# EasyEDA Pro project NU1680无线充电接收端底座.eprj, board 转接座
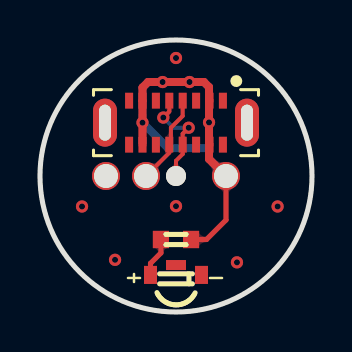
[diagram p4: board, top side]
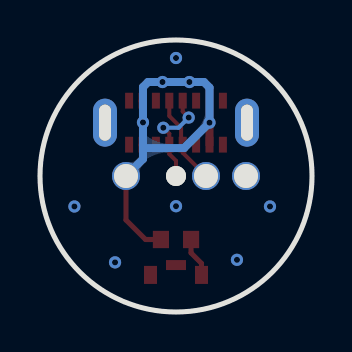
[diagram p5: board, bottom side, seen from below]

Outline 13.6 x 13.6 mm; copper layers: Top Layer, Bottom Layer. Coordinates in mm from the lower left corner of the outline.
Outline path: circle c6.8,6.8 r6.8
Stack: Top Layer 0.035mm / Dielectric1 1.51mm FR4 er 4.5 / Bottom Layer 0.035mm

## Design rules (mm)
net USB_DV_D+: DP1
net USB_DV_D-: DP1
template: JLCPCB Capability(Two Layers Board)
spacing copperThickness1oz (default): track to track 0.102, other pairs 0.152 to 0.3
spacing copperThickness2oz: track to track 0.203, other pairs 0.152 to 0.3
track width copperThickness1oz (default): min 0.127, default 0.254, max 2.54
track width copperThickness2oz: min 0.203, default 0.254, max 2.54
differential pair differentialPair (default): width min 0.127, default 0.254, max 2.54; gap min 0.152, default 0.152
via viaSize (default): diameter min 0.5, default 0.61, max 10; hole min 0.3, default 0.305, max 6.3

## Placement (name value [footprint] x y rotation side)
LED1  OUT  [LED-SMD_L3.2-W1.0-R-RD]  6.8 2.1 180 top
R1  1k  [R0603]  6.8 3.63 0 top
U1  -  [磁吸充电母座]  6.8 6.8 180 bottom
USB1  YTC-TC16S-128  [TYPE-C-SMD_YTC-TC16S-128]  6.8 9.47 0 top

## Footprints (pads in the part's own frame, mm; a bottom-side part is the same pattern mirrored in y, then rotated)
LED-SMD_L3.2-W1.0-R-RD
  rect 0.65x0.9 smd: 1(1.275,0.247) 2(-1.275,0.247)
  rect 1x0.5 smd: 3(0,-0.247)
R0603
  rect 0.806x0.864 smd: 1(-0.753,0) 2(0.753,0)
TYPE-C-SMD_YTC-TC16S-128
  rect 0.4x0.79 smd: A1(2.345,1.1) A4(1.675,1.1) A5(1.005,1.1) A6(0.335,1.1) A7(-0.335,1.1) A8(-1.005,1.1) A9(-1.675,1.1) A12(-2.345,1.1) B1(-2.345,-1.1) B4(-1.675,-1.1) B5(-1.005,-1.1) B6(-0.335,-1.1) B7(0.335,-1.1) B8(1.005,-1.1) B9(1.675,-1.1) B12(2.345,-1.1)
  oval 1.2x2.4 hole 0.6x1.8: EH1(-3.55,0) EH2(3.55,0)
磁吸充电母座
  round 1 hole 1.2x0.8: 1(0,0)
  round 1.4 hole 1.2: 2(1.5,0) 3(-2.5,0) 4(3.5,0)

## Nets
GND: LED1.2 U1.4 USB1.A1 USB1.A12 USB1.B1 USB1.B12 USB1.EH1 USB1.EH2
USB_DV_D+: U1.2 USB1.A6 USB1.B6
USB_DV_D-: U1.1 USB1.A7 USB1.B7
VOUTS: R1.2 U1.3 USB1.A4 USB1.A9 USB1.B4 USB1.B9
$1N898: LED1.1 R1.1

Pads without a net: LED1 3; USB1 A5 A8 B5 B8

## Via types
v1: diameter 0.61, hole 0.305, Top Layer to Bottom Layer, 12 vias

## Routing (per net, layer and track width the routed paths; a pad name or vN(x,y) marks a point on that pad's centre or on a via; arc(x,y) is an arc through that point)
GND:
  vias: v1(2.1,5.28) v1(3.75,2.61) v1(6.8,12.7) v1(6.8,5.29) v1(9.85,2.48) v1(11.88,5.28)
USB_DV_D+: length 4.5
  Top Layer w0.2: USB1.A6 7.14,9.8 6.55,9.21 6.55,8.45 USB1.B6 6.47,7.97 U1.2
USB_DV_D-: length 5.1
  Top Layer w0.2: v1(6.17,9.72) 6.47,10.02 USB1.A7 ; v1(7.44,9.21) 7.14,8.91 USB1.B7 7.14,7.9 6.8,7.56 U1.1
  Bottom Layer w0.2: v1(7.44,9.21) 6.67,9.21 v1(6.17,9.72)
VOUTS: length 29.6
  Top Layer w0.254: U1.3 9.3,4.6 8.32,3.63 R1.2
  Top Layer w0.4: U1.3 8.45,7.65 8.45,8.39 ; USB1.B4 v1(5.12,9.47) USB1.A9 5.12,11.22 5.4,11.5 v1(6.13,11.5) v1(7.48,11.5) 8.2,11.5 8.45,11.25 8.45,10.59 ; 8.45,8.39 USB1.B9 ; 8.45,8.39 v1(8.45,9.48) 8.45,10.59 ; 8.45,10.59 USB1.A4
  Bottom Layer w0.4: 8.45,8.19 8.44,8.2 6.4,8.2 v1(5.12,9.47) 5.12,11.22 5.4,11.5 v1(6.13,11.5) v1(7.48,11.5) 8.2,11.5 8.45,11.25 v1(8.45,9.48) 8.45,8.19 ; 8.45,8.19 8.45,7.65 U1.3
$1N898: length 2
  Top Layer w0.254: LED1.1 5.53,2.43 6.05,2.95 R1.1

## Copper pours and planes (outline as drawn; the poured copper is in the pictures)
GND on Top Layer: -1.45,14.55 15.31,14.55 15.31,-0.82 -1.45,-0.82
GND on Bottom Layer: -1.45,14.29 14.55,14.29 14.55,-0.57 -1.45,-0.57

Small or netless copper shapes (teardrops, artwork), in the pictures only: 24 on Top Layer, 13 on Bottom Layer
